# EAGLE design FrontPanel (EAGLE 7.3.0)
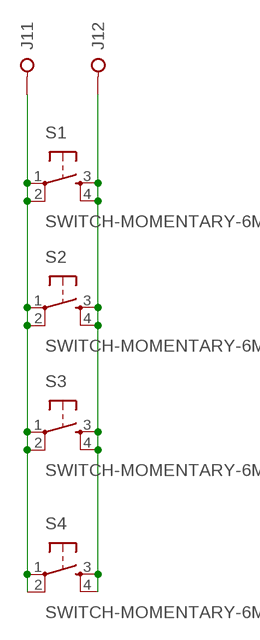
[diagram p0: schematic, sheet 1]

## Parts
J1  PINHD-1X2BIG  [1X02-BIG]
S1  SWITCH-MOMENTARY-6MM  [TACTILE-SWITCH-6MM]
S2  SWITCH-MOMENTARY-6MM  [TACTILE-SWITCH-6MM]
S3  SWITCH-MOMENTARY-6MM  [TACTILE-SWITCH-6MM]
S4  SWITCH-MOMENTARY-6MM  [TACTILE-SWITCH-6MM]

## Nets
N$1: J1.1 S1.1 S1.2 S2.1 S2.2 S3.1 S3.2 S4.1 S4.2
N$2: J1.2 S1.3 S1.4 S2.3 S2.4 S3.3 S3.4 S4.3 S4.4

## Library data of the parts
J1 = SaintGimp:PINHD-1X2
S1-S4 = SaintGimp:SWITCH-MOMENTARY: Momentary Switch Button commonly used for reset or general input. Spark Fun Electronics SKU : COM-00097 SMT- SWCH-08247

## Board
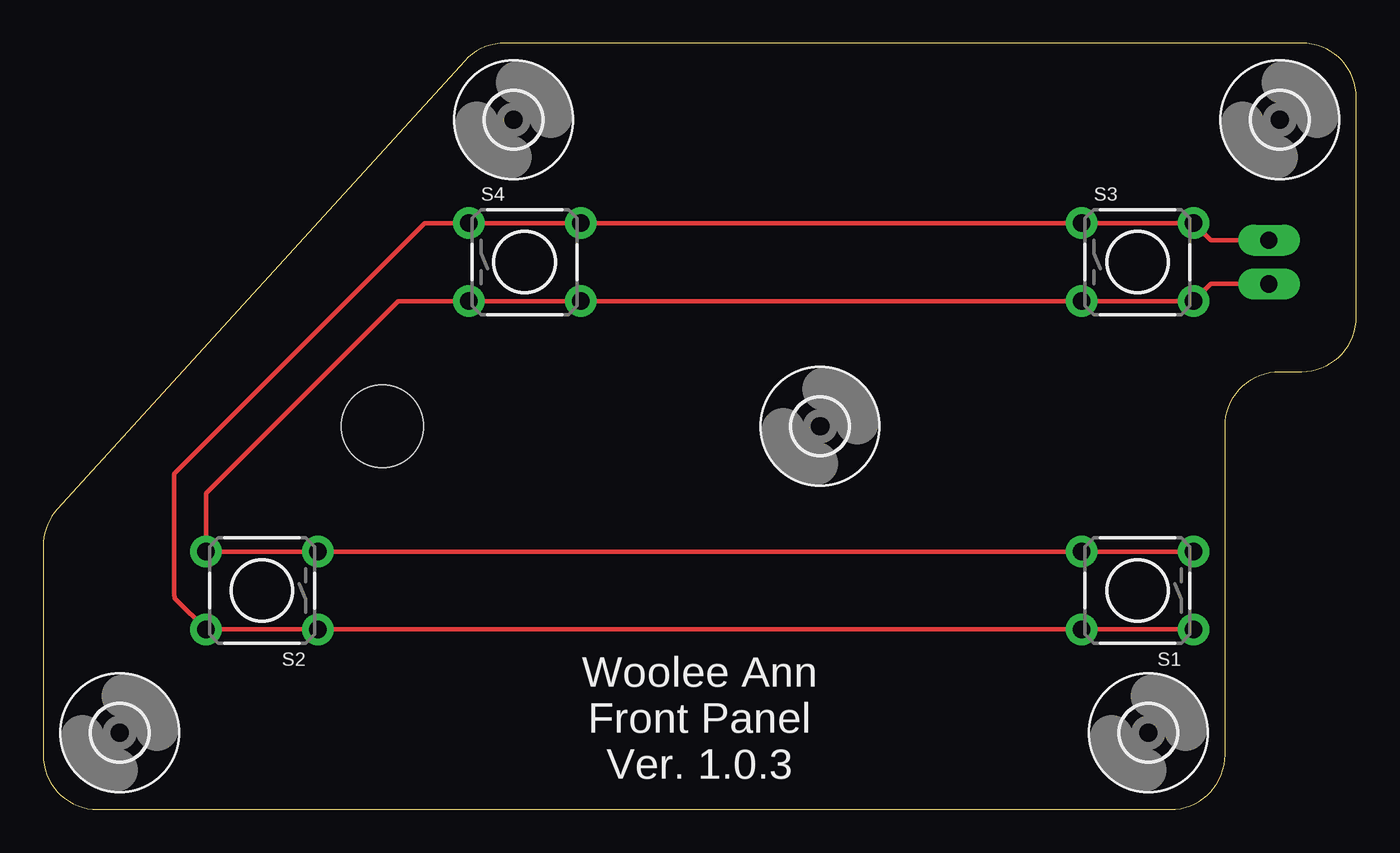
[diagram p1: board, top side]

Size 76.2 x 44.45 mm. Coordinates in mm from the lower left corner, seen from the top.
Outline: 76.2,28.57 76.2,41.27 arc90 73.03,44.45 26.8,44.45 arc48 24.45,43.41 0.83,17.42 arc42 0,15.28 0,3.17 arc90 3.17,0 65.41,0 arc90 68.58,3.17 68.58,22.23 arc-90 71.75,25.4 73.03,25.4 arc90 76.2,28.57
Copper layers (1*16): Top 0.0356mm / dielectric 1.5011mm / Bottom 0.0356mm
Design rules "Saintgimp-OSHPark": minimum track width 10mil, minimum drill 13mil, track to track 6mil, track to pad 6mil, pad to pad 6mil, via to via 6mil, smd to smd 6mil, copper to edge 15mil, drill to drill 6mil, minimum pad ring 12mil, minimum via ring 7mil, stop-mask expansion 2mil, vias tented up to drill 20mil, thermal gap 10mil
Holes 4.76 mm at 19.68,22.23

### Footprints (pad centres in the part's own frame; a part is rotated, then mirrored left to right if it is on the bottom)
1X02-BIG = drill 1 long: 1 -1.27,0; 2 1.27,0
TACTILE-SWITCH-6MM = drill 1.016: 1 -3.251,2.261; 2 3.251,2.261; 3 -3.251,-2.261; 4 3.251,-2.261
3,2 = hole 3.2: 0,0

### Placement (x,y rotation side)
J1  71.12,31.75 270 top
S1  63.5,12.7 180 top
S2  12.7,12.7 180 top
S3  63.5,31.75 0 top
S4  27.94,31.75 0 top
U$1  [3,2]  4.45,4.45 0 top
U$2  [3,2]  64.14,4.45 0 top
U$3  [3,2]  27.3,40.01 0 top
U$4  [3,2]  71.75,40.01 0 top
U$5  [3,2]  45.09,22.23 0 top

### Tracks (layer width: path | path; a pad name or v marks a point on that pad's centre or on a via)
N$1
  Top 0.254: S1.1 S1.2 S2.1 S2.2 7.71,12.18 arc-45 7.62,12.4 7.62,19.48 22.15,34.01 S4.1 S4.2 S3.1 S3.2 67.74,33.02 J1.1
N$2
  Top 0.254: S2.4 S2.3 S1.4 S1.3 | 9.53,15.04 S2.4 | J1.2 67.74,30.48 S3.4 S3.3 S4.4 S4.3 20.6,29.49 9.45,18.34 S2.4

### Text on the board
_tsilk: Woolee Ann / Front Panel / Ver. 1.0.3
_bsilk: RUN/STOP | GND